# Altium project PowerMeter.PrjPcb
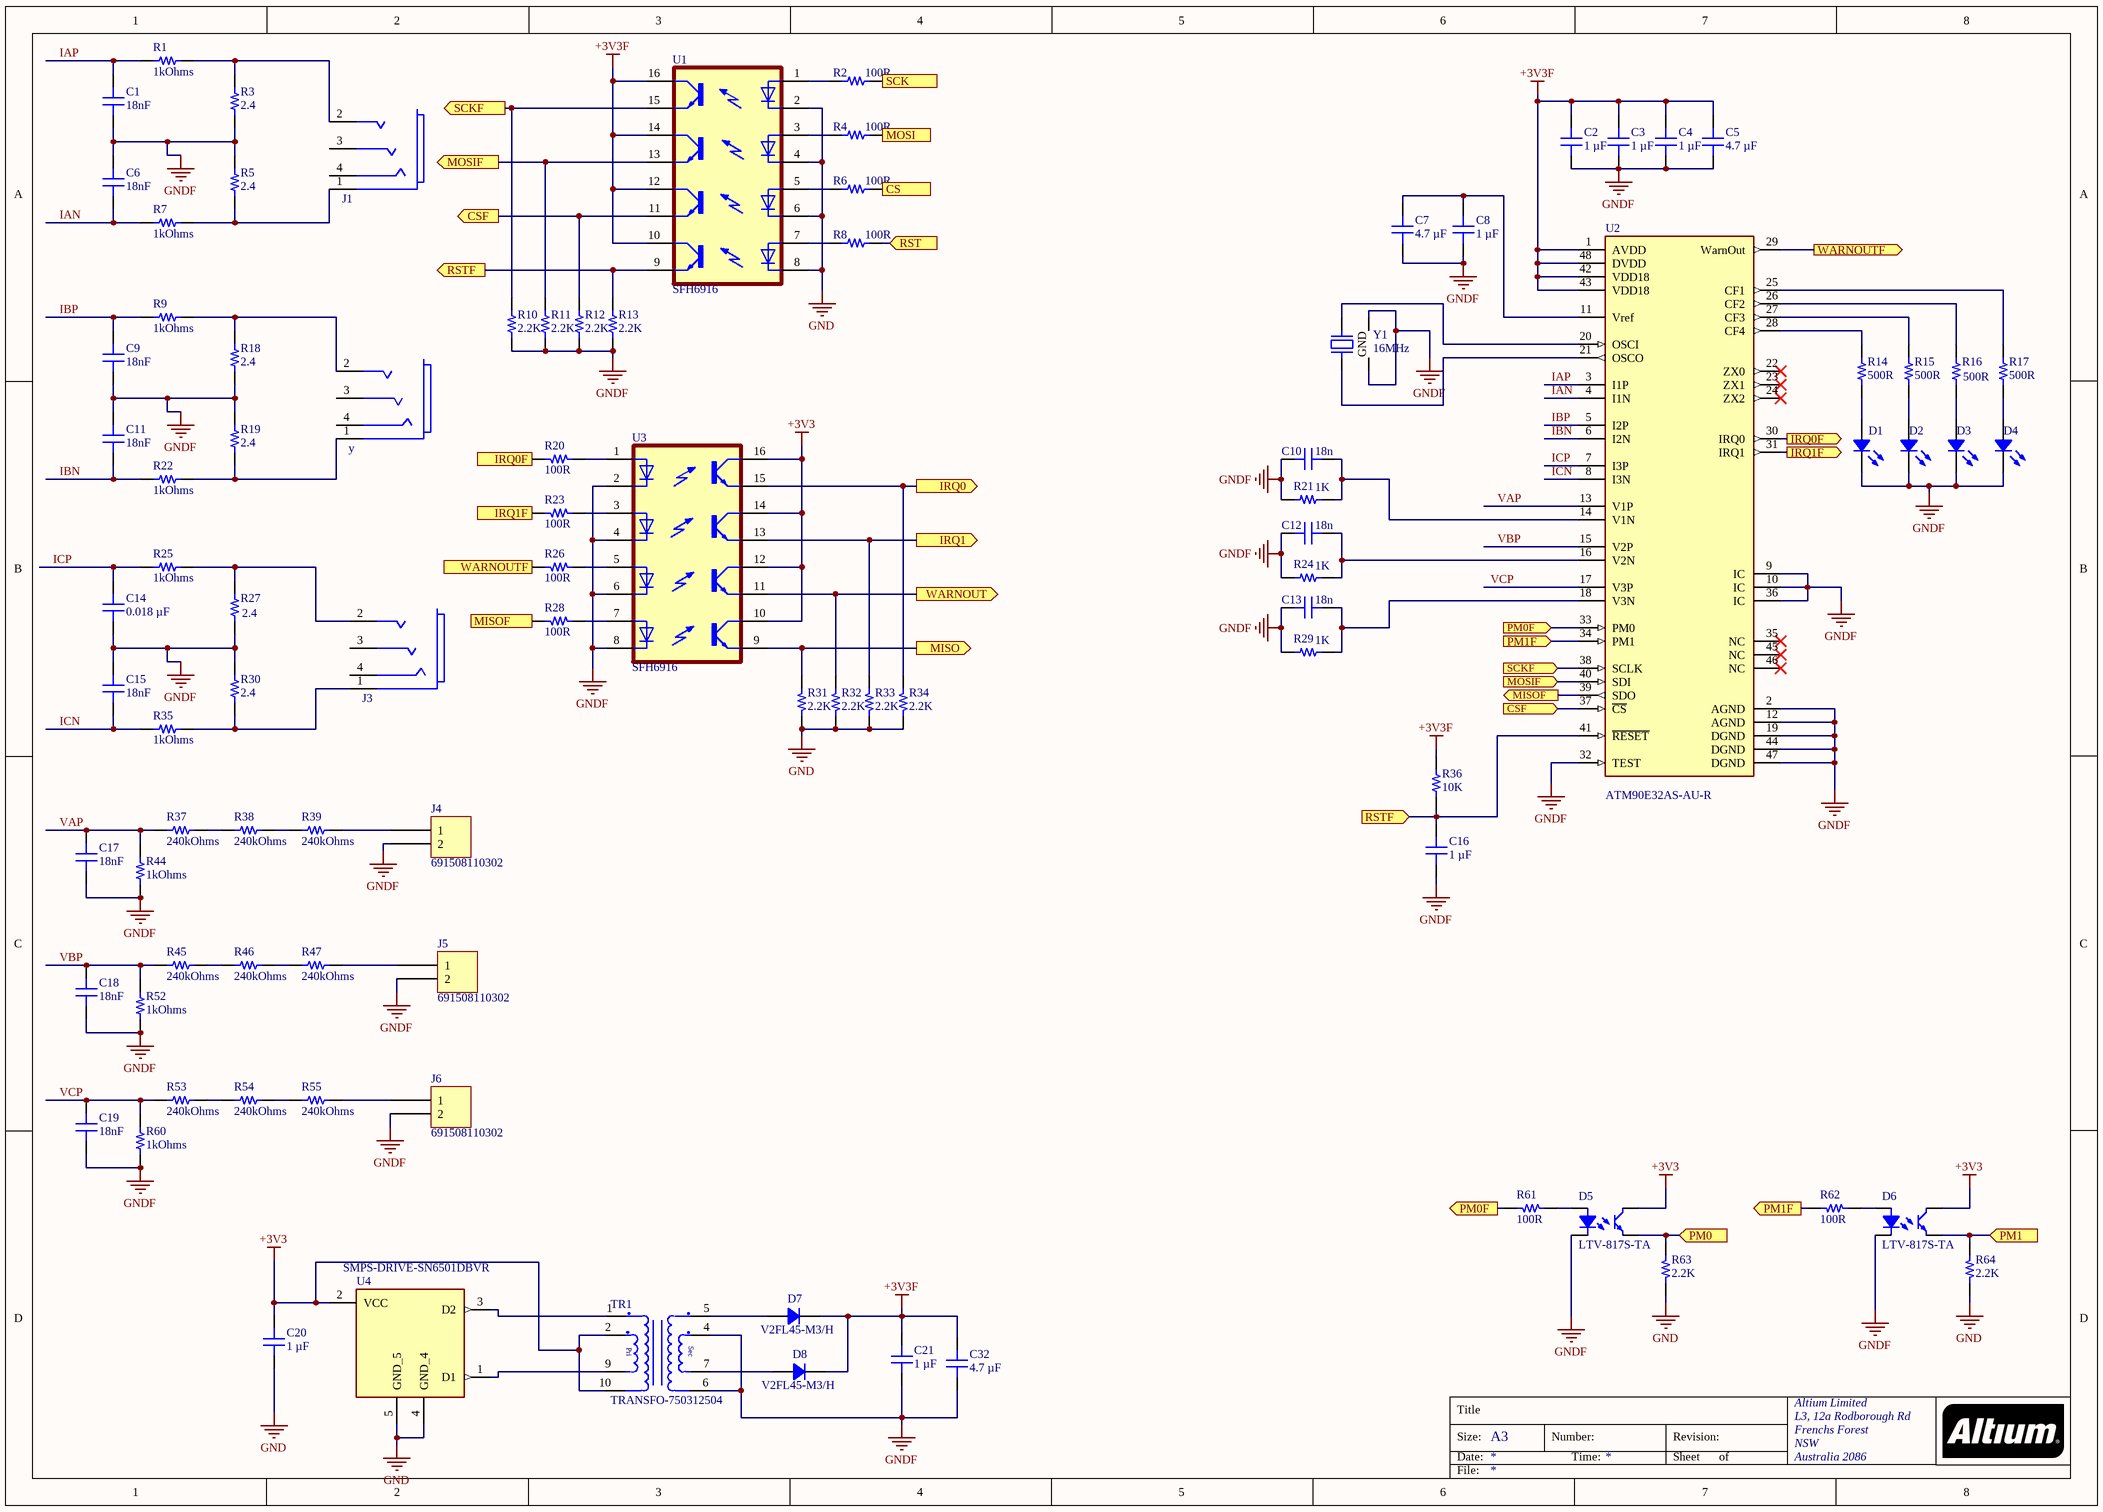
[diagram p0: schematic.SchDoc]
2 sheets, 108 parts. Net scope: flat (ports and power ports of the same name join across sheets).
Board file: pcb_layout.PcbDoc
Sheets:
  schematic.SchDoc
  power-supply.SchDoc

## Sheet schematic.SchDoc
size A3; Organization: Altium Limited; Address1: L3, 12a Rodborough Rd; Address2: Frenchs Forest; Address3: NSW; Address4: Australia 2086

### Parts
C1  18nF  [CAP 0805_2012]
C2  1 µF  [CAP 0603_1608]
C3  1 µF  [CAP 0603_1608]
C4  1 µF  [CAP 0603_1608]
C5  4.7 µF  [CAP 1206_3216 - 0.8MM]
C6  18nF  [CAP 0805_2012]
C7  4.7 µF  [CAP 1206_3216 - 0.8MM]
C8  1 µF  [CAP 0603_1608]
C9  18nF  [CAP 0805_2012]
C10  18n  [CAP 0805_2012]
C11  18nF  [CAP 0805_2012]
C12  18n  [CAP 0805_2012]
C13  18n  [CAP 0805_2012]
C14  0.018 µF  [CAP 0805_2012]
C15  18nF  [CAP 0805_2012]
C16  1 µF  [CAP 0603_1608]
C17  18nF  [CAP 0805_2012]
C18  18nF  [CAP 0805_2012]
C19  18nF  [CAP 0805_2012]
C20  1 µF  [CAP 0805_2012]
C21  1 µF  [CAP 0805_2012]
C32  4.7 µF  [CAP 1206_3216 - 0.8MM]
D1  Yellow  [LED 1206_3216 YELLOW]  (value not drawn)
D2  Yellow  [LED 1206_3216 YELLOW]  (value not drawn)
D3  Yellow  [LED 1206_3216 YELLOW]  (value not drawn)
D4  Yellow  [LED 1206_3216 YELLOW]  (value not drawn)
D5  LTV-817S-TA  [LITEON LTV-817]
D6  LTV-817S-TA  [LITEON LTV-817]
D7  V2FL45-M3/H  [SMF DO-219AB]
D8  V2FL45-M3/H  [SMF DO-219AB]
J1  SJ2-3574A-SMT-TR  [CON_JACK_AUDIO_CUISJ2-3574A-SMT-TR_MFG]  (value not drawn)
J3  SJ2-3574A-SMT-TR  [CON_JACK_AUDIO_CUISJ2-3574A-SMT-TR_MFG]  (value not drawn)
J4  691508110302  [WURTH 691508110302]
J5  691508110302  [WURTH 691508110302]
J6  691508110302  [WURTH 691508110302]
R1  1kOhms  [RES 0805_2012]
R2  100R  [RES 0805_2012]
R3  2.4  [RES 0805_2012]
R4  100R  [RES 0805_2012]
R5  2.4  [RES 0805_2012]
R6  100R  [RES 0805_2012]
R7  1kOhms  [RES 0805_2012]
R8  100R  [RES 0805_2012]
R9  1kOhms  [RES 0805_2012]
R10  2.2K  [RES 0805_2012]
R11  2.2K  [RES 0805_2012]
R12  2.2K  [RES 0805_2012]
R13  2.2K  [RES 0805_2012]
R14  500R  [RES 0805_2012]
R15  500R  [RES 0805_2012]
R16  500R  [RES 0805_2012]
R17  500R  [RES 0805_2012]
R18  2.4  [RES 0805_2012]
R19  2.4  [RES 0805_2012]
R20  100R  [RES 0805_2012]
R21  1K  [RES 0805_2012]
R22  1kOhms  [RES 0805_2012]
R23  100R  [RES 0805_2012]
R24  1K  [RES 0805_2012]
R25  1kOhms  [RES 0805_2012]
R26  100R  [RES 0805_2012]
R27  2.4  [RES 0805_2012]
R28  100R  [RES 0805_2012]
R29  1K  [RES 0805_2012]
R30  2.4  [RES 0805_2012]
R31  2.2K  [RES 0805_2012]
R32  2.2K  [RES 0805_2012]
R33  2.2K  [RES 0805_2012]
R34  2.2K  [RES 0805_2012]
R35  1kOhms  [RES 0805_2012]
R36  10K  [RES 0805_2012]
R37  240kOhms  [RES 0805_2012]
R38  240kOhms  [RES 0805_2012]
R39  240kOhms  [RES 0805_2012]
R44  1kOhms  [RES 0805_2012]
R45  240kOhms  [RES 0805_2012]
R46  240kOhms  [RES 0805_2012]
R47  240kOhms  [RES 0805_2012]
R52  1kOhms  [RES 0805_2012]
R53  240kOhms  [RES 0805_2012]
R54  240kOhms  [RES 0805_2012]
R55  240kOhms  [RES 0805_2012]
R60  1kOhms  [RES 0805_2012]
R61  100R  [RES 0805_2012]
R62  100R  [RES 0805_2012]
R63  2.2K  [RES 0805_2012]
R64  2.2K  [RES 0805_2012]
TR1  TRANSFO-750312504  [TRANSFO-750312504]
U1  SFH6916  [SOIC127P686X203-16N]
U2  ATM90E32AS-AU-R  [Microchip_TQFP48_IPC_A - duplicate]
U3  SFH6916  [SOIC127P686X203-16N]
U4  SMPS-DRIVE-SN6501DBVR  [SMPS-DRIVE-SOT95P280X145-5N]
y  SJ2-3574A-SMT-TR  [CON_JACK_AUDIO_CUISJ2-3574A-SMT-TR_MFG]  (value not drawn)
Y1  16MHz  [EPSON TSX-3225]

### Ports
CS (in), CSF (in), CSF (out), IRQ0 (out), IRQ0F (in), IRQ0F (out), IRQ1 (out), IRQ1F (in), IRQ1F (out), MISO (out), MISOF (in), MISOF (out), MOSI (in), MOSIF (in), MOSIF (out), PM0 (in), PM0F (in), PM0F (out), PM1 (in), PM1F (in), PM1F (out), RST (in), RSTF (in), RSTF (out), SCK (in), SCKF (in), SCKF (out), WARNOUT (out), WARNOUTF (in), WARNOUTF (out)

### Nets
+3V3: C20.2 D5.4 D6.4 TR1.2 TR1.10 U3.10(CO4) U3.12(CO3) U3.14(CO2) U3.16(CO1) U4.2(VCC)
+3V3F: C2.2 C3.2 C4.2 C5.2 C21.2 C32.2 D7.2 D8.2 R36.2 U1.10(CO4) U1.12(CO3) U1.14(CO2) U1.16(CO1) U2.1(AVDD) U2.42(VDD18) U2.43(VDD18) U2.48(DVDD)
GND: C20.1 R31.1 R32.1 R33.1 R34.1 R63.1 R64.1 U1.2(C1) U1.4(C2) U1.6(C3) U1.8(C4) U4.4(GND_4) U4.5(GND_5)
GNDF: C1.2 C2.1 C3.1 C4.1 C5.1 C6.1 C7.1 C8.1 C9.2 C10.1 C11.1 C12.1 C13.1 C14.1 C15.1 C16.1 C17.1 C18.1 C19.1 C21.1 C32.1 D1.2 D2.2 D3.2 D4.2 D5.2 D6.2 J4.2 J5.2 J6.2 R3.2 R5.1 R10.1 R11.1 R12.1 R13.1 R18.2 R19.1 R21.1 R24.1 R27.2 R29.1 R30.1 R44.1 R52.1 R60.1 TR1.4 TR1.6 U2.2(AGND) U2.9(IC) U2.10(IC) U2.12(AGND) U2.19(DGND) U2.32(TEST) U2.36(IC) U2.44(DGND) U2.47(DGND) U3.2(C1) U3.4(C2) U3.6(C3) U3.8(C4) Y1.2(GND) Y1.4(GND)
IAN: C6.2 R7.2 U2.4(I1N)
IAP: C1.1 R1.2 U2.3(I1P)
IBN: C11.2 R22.2 U2.6(I2N)
IBP: C9.1 R9.2 U2.5(I2P)
ICN: C15.2 R35.2 U2.8(I3N)
ICP: C14.2 R25.2 U2.7(I3P)
VAP: C17.2 R37.1 R44.2 U2.13(V1P)
VBP: C18.2 R45.1 R52.2 U2.15(V2P)
VCP: C19.2 R53.1 R60.2 U2.17(V3P)
NetC7_2: C7.2 C8.2 U2.11(Vref)
NetC10_2: C10.2 R21.2 U2.14(V1N)
NetC12_2: C12.2 R24.2 U2.16(V2N)
NetC13_2: C13.2 R29.2 U2.18(V3N)
NetC16_2: C16.2 R13.2 R36.1 U1.9(E4) U2.41(~{RESET}) ; port RSTF
NetD1_1: D1.1 R14.1
NetD2_1: D2.1 R15.2
NetD3_1: D3.1 R16.2
NetD4_1: D4.1 R17.2
NetD5_1: D5.1 R61.1
NetD5_3: D5.3 R63.2 ; port PM0
NetD6_1: D6.1 R62.1
NetD6_3: D6.3 R64.2 ; port PM1
NetD7_1: D7.1 TR1.5
NetD8_1: D8.1 TR1.7
NetJ1_1: J1.1(sleeve) R5.2 R7.1
NetJ1_2: J1.2(tip) R1.1 R3.1
NetJ3_1: J3.1(sleeve) R30.2 R35.1
NetJ3_2: J3.2(tip) R25.1 R27.1
NetJ4_1: J4.1 R39.2
NetJ5_1: J5.1 R47.2
NetJ6_1: J6.1 R55.2
NetR2_1: R2.1 U1.1(A1)
NetR2_2: R2.2 ; port SCK
NetR4_1: R4.1 U1.3(A2)
NetR4_2: R4.2 ; port MOSI
NetR6_1: R6.1 U1.5(A3)
NetR6_2: R6.2 ; port CS
NetR8_1: R8.1 U1.7(A4)
NetR8_2: R8.2 ; port RST
NetR9_1: R9.1 R18.1 y.2(tip)
NetR10_2: R10.2 U1.15(E1) U2.38(SCLK) ; port SCKF
NetR11_2: R11.2 U1.13(E2) U2.40(SDI) ; port MOSIF
NetR12_2: R12.2 U1.11(E3) U2.37(~{CS}) ; port CSF
NetR14_2: R14.2 U2.28(CF4)
NetR15_1: R15.1 U2.27(CF3)
NetR16_1: R16.1 U2.26(CF2)
NetR17_1: R17.1 U2.25(CF1)
NetR19_2: R19.2 R22.1 y.1(sleeve)
NetR20_1: R20.1 U3.1(A1)
NetR20_2: R20.2 U2.30(IRQ0) ; port IRQ0F
NetR23_1: R23.1 U3.3(A2)
NetR23_2: R23.2 U2.31(IRQ1) ; port IRQ1F
NetR26_1: R26.1 U3.5(A3)
NetR26_2: R26.2 U2.29(WarnOut) ; port WARNOUTF
NetR28_1: R28.1 U3.7(A4)
NetR28_2: R28.2 U2.39(SDO) ; port MISOF
NetR31_2: R31.2 U3.9(E4) ; port MISO
NetR32_2: R32.2 U3.11(E3) ; port WARNOUT
NetR33_2: R33.2 U3.13(E2) ; port IRQ1
NetR34_2: R34.2 U3.15(E1) ; port IRQ0
NetR37_2: R37.2 R38.1
NetR38_2: R38.2 R39.1
NetR45_2: R45.2 R46.1
NetR46_2: R46.2 R47.1
NetR53_2: R53.2 R54.1
NetR54_2: R54.2 R55.1
NetR61_2: R61.2 U2.33(PM0) ; port PM0F
NetR62_2: R62.2 U2.34(PM1) ; port PM1F
NetTR1_1: TR1.1 U4.3(D2)
NetTR1_9: TR1.9 U4.1(D1)
NetU2_20: U2.20(OSCI) Y1.3
NetU2_21: U2.21(OSCO) Y1.1

Not connected (* = marked no-connect by the designer): J1 3(ring_1) 4(ring_2); J3 3(ring_1) 4(ring_2); U2 22(ZX0)* 23(ZX1)* 24(ZX2)* 35(NC)* 45(NC)* 46(NC)*; y 3(ring_1) 4(ring_2)

### Notes on the sheet
- Title
- Size:
- Date:
- A3
- Number:
- Time:
- Revision:
- Sheet
- of
- File:
- (in symbol TRANSFO-750312504) Sec; Pri

### Library data of the parts
C1 C6 C9 C11 C15 C17-C19 = GQM2195C2E100FB12D: CAP CER 10PF 250V C0G/NP0 0805; Manufacturer: Murata Electronics; Temperature Coefficient: C0G, NP0; Tolerance: ±1%; Part Number: GQM2195C2E100FB12D; Value: 18nF; Applications: RF, Microwave, High Frequency; Capacitance: 10pF; ComponentLink1Description: Datasheet; ComponentLink1URL: https://www.murata.com/~/media/webrenewal/support/library/catalog/products/capacitor/mlcc/c02e.ashx?la=en-us; ComponentLink2Description: DigiKey Link; ComponentLink2URL: http://digikey.com/product-detail/en/murata-electronics/GQM2195C2E100FB12D/490-11280-1-ND/5333120; Device Package: 0805 (2012 Metric); Features: High Q, Low Loss; LastUpdated: 9/2/2020 1:04:42 AM; Lifecycle Status: Active; Minimum Order: 1; Mounting Type: Surface Mount, MLCC; Operating Temperature: -55°C ~ 125°C; Package / Case: 0805 (2012 Metric); Packaging: TapeAndReel; PartId: 2417; Part Status: Active; Price: 0.48; Series: GQM; Size / Dimension: 0.079" L x 0.049" W (2.00mm x 1.25mm); Supplier 1: DigiKey; Supplier Part Number 1: 490-11280-1-ND; Thickness (Max): 0.037" (0.95mm); Voltage - Rated: 250V
C2-C4 C8 C16 = C0603C105K4RACAUTO: CAP CER 0603 1UF 16V X7R 10%; manufacturer: KEMET; Part Number: C0603C105K4RACAUTO; Value: 1 µF; Applications: Automotive, Bypass, Decoupling; Capacitance: 1 µF; componentlink1description: Datasheet; componentlink1url: https://api.kemet.com/component-edge/download/datasheet/C0603C105K4RACAUTO.pdf; componentlink2description: DigiKey Link; componentlink2url: https://www.digikey.com/en/products/detail/kemet/C0603C105K4RACAUTO/8635831; Device Package: 0603 (1608 Metric); lastupdated: 6/30/2022 10:03:44 PM; Lifecycle Status: Active; Minimum Order: 1; Mounting Type: Surface Mount, MLCC; Operating Temperature: -55°C ~ 125°C; Package / Case: 0603 (1608 Metric); packaging: TapeAndReel; partid: 2179; Part Status: Active; price: 0.01; Ratings: AEC-Q200; series: SMD Auto X7R; Size / Dimension: 0.063" L x 0.031" W (1.60mm x 0.80mm); Supplier 1: DigiKey; Supplier Part Number 1: 399-17704-1-ND; Temperature Coefficient: X7R; Thickness (Max): 0.037" (0.95mm); Tolerance: ±10%; Voltage - Rated: 16V
C5 C7 C32 = EMF316AB7475KLHT: CAP, MLCC, 1206/3216, 16V, X7R,; manufacturer: Taiyo Yuden; Tolerance: ±10%; Part Number: EMF316AB7475KLHT; Value: 4.7 µF; Applications: Automotive, SMPS Filtering; Capacitance: 4.7 µF; componentlink1description: Datasheet; componentlink1url: https://ds.yuden.co.jp/TYCOMPAS/ut/detail?pn=EMF316AB7475KLHT&u=M; componentlink2description: DigiKey Link; componentlink2url: https://www.digikey.com/en/products/detail/taiyo-yuden/EMF316AB7475KLHT/10379053; Device Package: 1206 (3216 Metric); lastupdated: 6/30/2022 10:08:55 PM; Lifecycle Status: Active; Minimum Order: 1; Mounting Type: Surface Mount, MLCC; Operating Temperature: -55°C ~ 125°C; Package / Case: 1206 (3216 Metric); packaging: TapeAndReel; partid: 22602; Part Status: Active; price: 0.10; Ratings: AEC-Q200; series: M; Size / Dimension: 0.126" L x 0.063" W (3.20mm x 1.60mm); Supplier 1: DigiKey; Supplier Part Number 1: 587-6487-1-ND; Temperature Coefficient: X7R; Thickness (Max): 0.071" (1.80mm); Voltage - Rated: 16V
C10 C12 C13 = CC0805KRX7R0BB183: CAP CER 0.018UF 100V X7R 0805; manufacturer: Yageo; Capacitance: 0.018 µF; Tolerance: ±10%; Part Number: CC0805KRX7R0BB183; Value: 18n; Applications: General Purpose; componentlink1description: Datasheet; componentlink1url: http://www.yageo.com/documents/recent/UPY-NP0X7R_MV_100-to-630V_21.pdf; componentlink2description: DigiKey Link; componentlink2url: https://www.digikey.com/en/products/detail/yageo/CC0805KRX7R0BB183/5884190; Device Package: 0805 (2012 Metric); Features: High Voltage; lastupdated: 6/30/2022 10:07:03 PM; Lifecycle Status: Active; Minimum Order: 1; Mounting Type: Surface Mount, MLCC; Operating Temperature: -55°C ~ 125°C; Package / Case: 0805 (2012 Metric); packaging: TapeAndReel; partid: 2523; Part Status: Active; price: 0.02; series: CC; Size / Dimension: 0.079" L x 0.049" W (2.00mm x 1.25mm); Supplier 1: DigiKey; Supplier Part Number 1: 311-4304-1-ND; Temperature Coefficient: X7R; Thickness (Max): 0.057" (1.45mm); Voltage - Rated: 100V
C14 = CC0805KRX7R0BB183: CAP CER 0.018UF 100V X7R 0805; manufacturer: Yageo; Tolerance: ±10%; Part Number: CC0805KRX7R0BB183; Value: 0.018 µF; Applications: General Purpose; Capacitance: 0.018 µF; componentlink1description: Datasheet; componentlink1url: http://www.yageo.com/documents/recent/UPY-NP0X7R_MV_100-to-630V_21.pdf; componentlink2description: DigiKey Link; componentlink2url: https://www.digikey.com/en/products/detail/yageo/CC0805KRX7R0BB183/5884190; Device Package: 0805 (2012 Metric); Features: High Voltage; lastupdated: 7/14/2022 11:52:55 AM; Lifecycle Status: Active; Minimum Order: 1; Mounting Type: Surface Mount, MLCC; Operating Temperature: -55°C ~ 125°C; Package / Case: 0805 (2012 Metric); packaging: TapeAndReel; partid: 2523; Part Status: Active; price: 0.02; series: CC; Size / Dimension: 0.079" L x 0.049" W (2.00mm x 1.25mm); Supplier 1: DigiKey; Supplier Part Number 1: 311-4304-1-ND; Temperature Coefficient: X7R; Thickness (Max): 0.057" (1.45mm); Voltage - Rated: 100V
C20 C21 = CGA4J3X8R1C105K125AB: CAP CER 1UF 16V X8R 0805; manufacturer: TDK Corporation; Tolerance: ±10%; Part Number: CGA4J3X8R1C105K125AB; Value: 1 µF; Applications: Automotive; Capacitance: 1 µF; componentlink1description: Datasheet; componentlink1url: https://product.tdk.com/info/en/catalog/datasheets/mlcc_automotive_hightemp_en.pdf?ref_disty=digikey; componentlink2description: DigiKey Link; componentlink2url: https://www.digikey.com/en/products/detail/tdk-corporation/CGA4J3X8R1C105K125AB/3950048; Device Package: 0805 (2012 Metric); Features: High Temperature; lastupdated: 6/30/2022 10:07:02 PM; Lifecycle Status: Active; Minimum Order: 1; Mounting Type: Surface Mount, MLCC; Operating Temperature: -55°C ~ 150°C; Package / Case: 0805 (2012 Metric); packaging: TapeAndReel; partid: 3048; Part Status: Active; price: 0.08; Ratings: AEC-Q200; series: CGA; Size / Dimension: 0.079" L x 0.049" W (2.00mm x 1.25mm); Supplier 1: DigiKey; Supplier Part Number 1: 445-12812-1-ND; Temperature Coefficient: X8R; Thickness (Max): 0.057" (1.45mm); Voltage - Rated: 16V
D1-D4 = 5990240007F: LED YELLOW 1206 SMD; Manufacturer: Dialight; Configuration: Standard; Current - Test: 20mA; Lens Color: 0.80mm; Lens Size: 2.00mm x 1.60mm; Lens Style: Rectangle with Flat Top; Millicandela Rating: 126mcd; Viewing Angle: 140°; Voltage - Forward (Vf) (Typ): 2.1V; Wavelength - Dominant: 590nm; Part Number: 5990240007F; Color: Yellow; ComponentLink1Description: Datasheet; ComponentLink1URL: http://www.dialightsignalsandcomponents.com/Assets/Brochures_And_Catalogs/Indication/CBI_SMD_new/Dialight_CBI_data_599-1206_Apr2018.pdf; ComponentLink2Description: DigiKey Link; ComponentLink2URL: https://www.digikey.com/en/products/detail/dialight/5990240007F/9385418; Device Package: 1206 (3216 Metric); Height (Max): 0.80mm; LastUpdated: 6/30/2022 10:51:53 PM; Lifecycle Status: Active; Minimum Order: 1; Mounting Type: Surface Mount; Package / Case: 1206 (3216 Metric); Packaging: TapeAndReel; PartId: 1; Part Status: Active; Price: 0.04; Series: 599; Size / Dimension: 3.20mm L x 1.60mm W; Supplier 1: DigiKey; Supplier Part Number 1: 350-4363-1-ND; Supplier Device Package: 1206; Value: Yellow
D5 D6 = LTV-817S-TA: OPTOISOLATR 5KV TRANSISTOR 4-SMD; Manufacturer: Lite-On Inc.; Current - DC Forward (If) (Max): 50mA; Current Transfer Ratio (Max): 600% @ 5mA; Current Transfer Ratio (Min): 50% @ 5mA; Input Type: DC; Number of Channels: 1; Rise / Fall Time (Typ): 4µs, 3µs; Vce Saturation (Max): 200mV; Voltage - Forward (Vf) (Typ): 1.2V; Voltage - Isolation: 5000Vrms; Voltage - Output (Max): 35V; Part Number: LTV-817S-TA; ComponentLink1Description: Datasheet; ComponentLink1URL: http://optoelectronics.liteon.com/upload/download/DS-70-96-0016/LTV-8X7%20series%20201610%20.pdf; ComponentLink2Description: DigiKey Link; ComponentLink2URL: http://digikey.com/product-detail/en/lite-on-inc/LTV-817S-TA/160-2038-1-ND/3711420; Current - Output / Channel: 50mA; Device Package: 4-SMD, Gull Wing; LastUpdated: 1/12/2020 9:59:02 PM; Lifecycle Status: Active; Minimum Order: 1; Mounting Type: Surface Mount; Operating Temperature: -30°C ~ 110°C; Output Type: Transistor; Package / Case: 4-SMD, Gull Wing; Packaging: TapeAndReel; Part Status: Active; Price: 0.12; Series: -; Supplier 1: DigiKey; Supplier Part Number 1: 160-2038-1-ND; Supplier Device Package: 4-SMD
D7 D8 = V2FL45-M3/H: 2A,45V,SMF,TRENCH SKY RECT.; Manufacturer: Vishay Semiconductor Diodes Division; Capacitance @ Vr, F: 270pF @ 4V, 1MHz; Current - Reverse Leakage @ Vr: 570µA @ 45V; Diode Type: Schottky; Speed: Fast Recovery =< 500ns, > 200mA (Io); Voltage - Forward (Vf) (Max) @ If: 560mV @ 2A; Part Number: V2FL45-M3/H; ComponentLink1Description: Datasheet; ComponentLink1URL: http://www.vishay.com/docs/87561/v2fl45.pdf; ComponentLink2Description: DigiKey Link; ComponentLink2URL: http://digikey.com/product-detail/en/vishay-semiconductor-diodes-division/V2FL45-M3-H/V2FL45-M3-HGICT-ND/9360081; Current - Average Rectified (Io): 2A; LastUpdated: 6/30/2022 10:54:15 PM; Lifecycle Status: Active; Minimum Order: 1; Mounting Type: Surface Mount; Operating Temperature - Junction: -40°C ~ 150°C; Package / Case: DO-219AB; Packaging: TapeAndReel; PartId: 1281; Part Status: Active; Price: 0.08; Series: eSMP®, TMBS®; Supplier 1: DigiKey; Supplier Part Number 1: V2FL45-M3/HGICT-ND; Supplier Device Package: DO-219AB (SMF); Voltage - DC Reverse (Vr) (Max): 45V
J1 J3 y = CON_JACK_AUDIO_SJ2-3574A-SMT-TR: 3.5 mm, Stereo, Right Angle, Surface Mount (SMT), Audio Jack Connector
J4-J6 = 691508110302: TERM BLOCK 2POS 3.5MM SMD; Manufacturer: Würth Elektronik; Current: 10A; Mating Orientation: Horizontal and Vertical with Board; Number of Levels: 1; Pitch: 0.138" (3.50mm); Positions Per Level: 2; Voltage: 300V; Wire Gauge: 16-30 AWG; Wire Termination: Screw - Rising Cage Clamp; Part Number: 691508110302; Color: Black; ComponentLink1Description: Datasheet; ComponentLink1URL: https://katalog.we-online.de/em/datasheet/6915081103xx.pdf; ComponentLink2Description: DigiKey Link; ComponentLink2URL: http://digikey.com/product-detail/en/w-rth-elektronik/691508110302/732-5963-1-ND/5047612; Features: Board Guide, Mounting Flange; LastUpdated: 1/15/2020 4:18:55 AM; Lifecycle Status: Active; Minimum Order: 1; Mounting Type: Surface Mount; Packaging: TapeAndReel; Part Status: Active; Price: 1.57; Series: WR-TBL Series 5081; Supplier 1: DigiKey; Supplier Part Number 1: 732-5963-1-ND
R1 R3 R5 R7 R9 R18 R19 R22 R25 R27 R30 R35 R37-R39 R44-R47 R52-R55 R60 = RC0805FR-0710KP: RES SMD 10K OHM 1% 1/8W 0805; Manufacturer: Yageo; Power (Watts): 0.125W, 1/8W; Resistance: 10 kOhms; Temperature Coefficient: ±100ppm/°C; Part Number: RC0805FR-0710KP; ComponentLink1Description: Datasheet; ComponentLink1URL: http://www.yageo.com/NewPortal/yageodocoutput?fileName=/pdf/R-Chip/PYu-RC_51_RoHS_P_0.pdf; ComponentLink2Description: DigiKey Link; ComponentLink2URL: http://digikey.com/product-detail/en/yageo/RC0805FR-0710KP/YAG1319CT-ND/4935432; Composition: Thick Film; Device Package: 0805 (2012 Metric); Features: Moisture Resistant; Height - Seated (Max): 0.024" (0.60mm); LastUpdated: 9/2/2020 1:14:57 AM; Lifecycle Status: Active; Minimum Order: 1; Number of Terminations: 2; Operating Temperature: -55°C ~ 155°C; Package / Case: 0805 (2012 Metric); Packaging: TapeAndReel; PartId: 39882; Part Status: Active; Price: 0.01; Series: RC-P Lead Free; Size / Dimension: 0.079" L x 0.049" W (2.00mm x 1.25mm); Supplier 1: DigiKey; Supplier Part Number 1: YAG1319CT-ND; Supplier Device Package: 0805; Tolerance: ±1%
  R1 R7 R9 R22 R25 R35 R44 R52 R60: Value: 1kOhms
  R3 R5 R18 R19 R27 R30: Value: 2.4
  R37-R39 R45-R47 R53-R55: Value: 240kOhms
R2 R4 R6 R8 R20 R23 R26 R28 R61 R62 = RCS0805100RFKEA: RES SMD 100 OHM 1% 0.4W 0805; Manufacturer: Vishay Dale; Power (Watts): 0.4W, 2/5W; Resistance: 100 Ohms; Temperature Coefficient: ±100ppm/°C; Part Number: RCS0805100RFKEA; Value: 100R; ComponentLink1Description: Datasheet; ComponentLink1URL: http://www.vishay.com/docs/20065/rcse3.pdf; ComponentLink2Description: DigiKey Link; ComponentLink2URL: https://www.digikey.com/en/products/detail/vishay-dale/RCS0805100RFKEA/5866980; Composition: Thick Film; Device Package: 0805 (2012 Metric); Features: Automotive AEC-Q200, Pulse Withstanding; Height - Seated (Max): 0.020" (0.50mm); LastUpdated: 6/30/2022 10:39:30 PM; Lifecycle Status: Active; Minimum Order: 1; Number of Terminations: 2; Operating Temperature: -55°C ~ 155°C; Package / Case: 0805 (2012 Metric); Packaging: TapeAndReel; PartId: 27784; Part Status: Active; Price: 0.03; Ratings: AEC-Q200; Series: RCS e3; Size / Dimension: 0.079" L x 0.049" W (2.00mm x 1.25mm); Supplier 1: DigiKey; Supplier Part Number 1: 541-2834-1-ND; Supplier Device Package: 0805; Tolerance: ±1%
R10-R13 R31-R34 R63 R64 = SR0805JR-7W2K2L: RES SMD 2.2K OHM 5% 1/4W 0805; Manufacturer: Yageo; Power (Watts): 0.25W, 1/4W; Resistance: 2.2 kOhms; Temperature Coefficient: ±200ppm/°C; Part Number: SR0805JR-7W2K2L; Value: 2.2K; ComponentLink1Description: Datasheet; ComponentLink1URL: http://www.yageo.com/documents/recent/PYu-SR_20105_RoHS_L_8.pdf; ComponentLink2Description: DigiKey Link; ComponentLink2URL: http://digikey.com/product-detail/en/yageo/SR0805JR-7W2K2L/YAG6054CT-ND/9696508; Composition: Thick Film; Device Package: 0805 (2012 Metric); Features: Automotive AEC-Q200, Pulse Withstanding; Height - Seated (Max): 0.024" (0.60mm); LastUpdated: 6/30/2022 10:39:29 PM; Lifecycle Status: Active; Minimum Order: 1; Number of Terminations: 2; Operating Temperature: -55°C ~ 155°C; Package / Case: 0805 (2012 Metric); Packaging: TapeAndReel; PartId: 27793; Part Status: Active; Price: 0.03; Ratings: AEC-Q200; Series: SR; Size / Dimension: 0.079" L x 0.049" W (2.00mm x 1.25mm); Supplier 1: DigiKey; Supplier Part Number 1: YAG6054CT-ND; Supplier Device Package: 0805; Tolerance: ±5%
R14-R17 = TNPU0805500RAZEN00: RES SMD 500 OHM 0.05% 1/8W 0805; Manufacturer: Vishay Dale; Power (Watts): 0.125W, 1/8W; Resistance: 500 Ohms; Temperature Coefficient: ±5ppm/°C; Part Number: TNPU0805500RAZEN00; Value: 500R; ComponentLink1Description: Datasheet; ComponentLink1URL: http://www.vishay.com/docs/28779/tnpue3.pdf; ComponentLink2Description: DigiKey Link; ComponentLink2URL: http://digikey.com/product-detail/en/vishay-dale/TNPU0805500RAZEN00/541-3305-1-ND/6615962; Composition: Thin Film; Device Package: 0805 (2012 Metric); Features: Anti-Sulfur, Automotive AEC-Q200, Moisture Resistant; Height - Seated (Max): 0.022" (0.55mm); LastUpdated: 6/30/2022 10:39:04 PM; Lifecycle Status: Active; Minimum Order: 1; Number of Terminations: 2; Operating Temperature: -55°C ~ 125°C; Package / Case: 0805 (2012 Metric); Packaging: TapeAndReel; PartId: 34406; Part Status: Active; Price: 1.23; Ratings: AEC-Q200; Series: TNPU; Size / Dimension: 0.079" L x 0.049" W (2.00mm x 1.25mm); Supplier 1: DigiKey; Supplier Part Number 1: 541-3305-1-ND; Supplier Device Package: 0805; Tolerance: ±0.05%
R21 R24 R29 = RNCS0805BKE1K00: RES 1K OHM 0.1% 1/10W 0805; Manufacturer: Stackpole Electronics Inc; Power (Watts): 0.1W, 1/10W; Resistance: 1 kOhms; Temperature Coefficient: ±25ppm/°C; Part Number: RNCS0805BKE1K00; Value: 1K; ComponentLink1Description: Datasheet; ComponentLink1URL: https://www.seielect.com/catalog/sei-rncs_rnch.pdf; ComponentLink2Description: DigiKey Link; ComponentLink2URL: https://www.digikey.com/en/products/detail/stackpole-electronics-inc/RNCS0805BKE1K00/1800073; Composition: Thin Film; Device Package: 0805 (2012 Metric); Features: Anti-Corrosive, Automotive AEC-Q200, Moisture Resistant; Height - Seated (Max): 0.026" (0.65mm); LastUpdated: 6/30/2022 10:39:30 PM; Lifecycle Status: Active; Minimum Order: 1; Number of Terminations: 2; Operating Temperature: -55°C ~ 155°C; Package / Case: 0805 (2012 Metric); Packaging: TapeAndReel; PartId: 27715; Part Status: Active; Price: 0.09; Ratings: AEC-Q200; Series: RNCS; Size / Dimension: 0.079" L x 0.049" W (2.00mm x 1.25mm); Supplier 1: DigiKey; Supplier Part Number 1: RNCS0805BKE1K00CT-ND; Supplier Device Package: 0805; Tolerance: ±0.1%
R36 = RNCS0805BKE10K0: RES 10K OHM 0.1% 1/10W 0805; Manufacturer: Stackpole Electronics Inc; Power (Watts): 0.1W, 1/10W; Resistance: 10 kOhms; Temperature Coefficient: ±25ppm/°C; Part Number: RNCS0805BKE10K0; Value: 10K; ComponentLink1Description: Datasheet; ComponentLink1URL: https://www.seielect.com/catalog/sei-rncs_rnch.pdf; ComponentLink2Description: DigiKey Link; ComponentLink2URL: https://www.digikey.com/en/products/detail/stackpole-electronics-inc/RNCS0805BKE10K0/1800067; Composition: Thin Film; Device Package: 0805 (2012 Metric); Features: Anti-Corrosive, Automotive AEC-Q200, Moisture Resistant; Height - Seated (Max): 0.026" (0.65mm); LastUpdated: 6/30/2022 10:39:30 PM; Lifecycle Status: Active; Minimum Order: 1; Number of Terminations: 2; Operating Temperature: -55°C ~ 155°C; Package / Case: 0805 (2012 Metric); Packaging: TapeAndReel; PartId: 27713; Part Status: Active; Price: 0.09; Ratings: AEC-Q200; Series: RNCS; Size / Dimension: 0.079" L x 0.049" W (2.00mm x 1.25mm); Supplier 1: DigiKey; Supplier Part Number 1: RNCS0805BKE10K0CT-ND; Supplier Device Package: 0805; Tolerance: ±0.1%
TR1 = TRANSFO-750312504: Capacitor Charger For For DC/DC Converters SMPS Transformer 500VDC Isolation - Surface Mount
U1 U3 = SFH6916: MF: {'manufacturer': u'Vishay'}; Package: None; Price: None; Value: *; MP: SFH6916; Availability: Unavailable
U2 = ATM90E32AS-AU-R: Smart Energy SoC, 3 - 3.6 VCC, -40 to 85 degC, TQFP-48, RoHS; Supplier 1: Avnet; Supplier Part Number 1: ATM90E32AS-AU-R
U4 = SMPS-DRIVE-SN6501DBVR: Low-noise, 350-mA, 410-kHz transformer driver for isolated power supplies 5-SOT-23 -40 to 125; MF: Texas Instruments; SnapEDA_Link: https://www.snapeda.com/parts/SN6501DBVR/Texas%20Instruments/view-part/49700/?ref=snap; MP: SN6501DBVR; Check_prices: https://www.snapeda.com/parts/SN6501DBVR/Texas%20Instruments/view-part/49700/?ref=eda; Digi-Key_Part_Number: 296-37700-1-ND; Value: *; Purchase-URL: https://pricing.snapeda.com/search/part/SN6501DBVR/?ref=eda; Package: SOT-23-5 Texas Instruments
Y1 = TSX-3225 16.0000MF18X-AC3: CRYSTAL 16.0000MHZ 9PF SMD; Manufacturer: EPSON; ESR (Equivalent Series Resistance): 60 Ohms; Frequency Stability: ±18ppm; Frequency Tolerance: ±10ppm; Operating Mode: Fundamental; Part Number: TSX-3225 16.0000MF18X-AC3; ComponentLink1Description: Datasheet; ComponentLink1URL: https://support.epson.biz/td/api/doc_check.php?dl=brief_TSX-3225&lang=en; ComponentLink2Description: DigiKey Link; ComponentLink2URL: http://digikey.com/product-detail/en/epson/TSX-3225-16.0000MF18X-AC3/SER3636CT-ND/1825448; Frequency: 16MHz; Height - Seated (Max): 0.024" (0.60mm); LastUpdated: 7/21/2022 4:44:27 AM; Lifecycle Status: Active; Load Capacitance: 9pF; Minimum Order: 1; Mounting Type: Surface Mount; Operating Temperature: -40°C ~ 85°C; Package / Case: 4-SMD, No Lead; Packaging: TapeAndReel; PartId: 443; Part Status: Active; Price: 0.22; Series: TSX-3225; Size / Dimension: 0.126" L x 0.098" W (3.20mm x 2.50mm); Supplier 1: DigiKey; Supplier Part Number 1: SER3636CT-ND; Type: MHz Crystal; Value: 16MHz

## Sheet power-supply.SchDoc
size A3
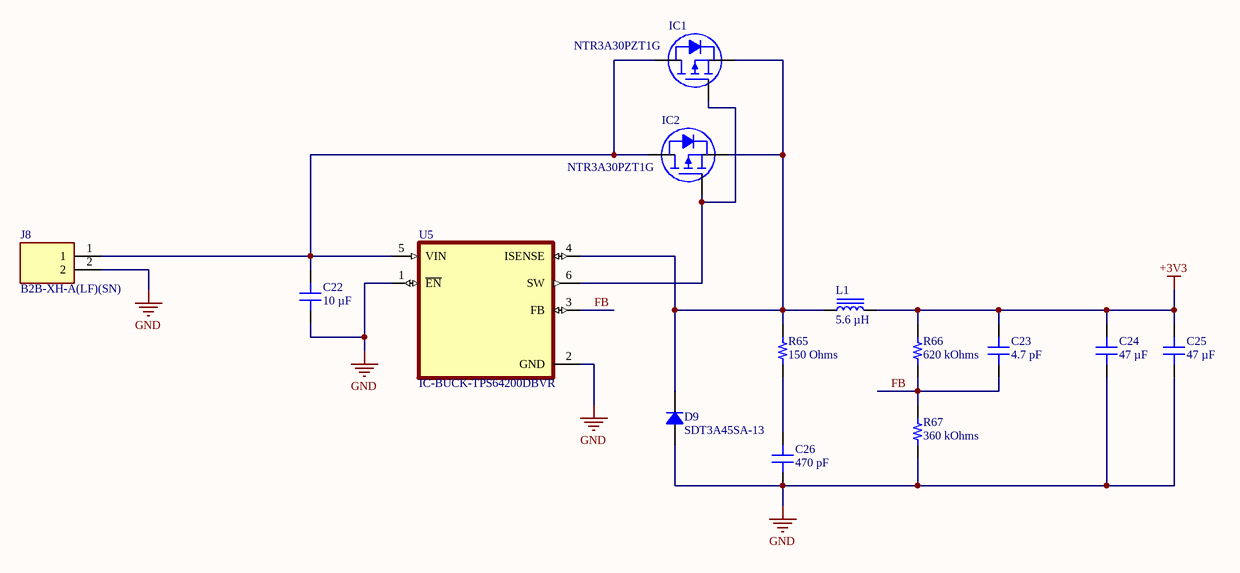
[diagram p1: power-supply.SchDoc]

### Parts
C22  10 µF  [CAP 1206_3216 - 0.8MM]
C23  4.7 pF  [CAP 0603_1608]
C24  47 µF  [CAP 0603_1608]
C25  47 µF  [CAP 1206_3216 - 0.8MM]
C26  470 pF  [CAP 0603_1608]
D9  SDT3A45SA-13  [DO214AC SMA]
IC1  NTR3A30PZT1G  [ON SEMI SOT-23-3]
IC2  NTR3A30PZT1G  [ON SEMI SOT-23-3]
J8  B2B-XH-A(LF)(SN)  [JST_B2B-XH-A(LF)(SN)]
L1  5.6 µH  [BOURNS SRP5030T]
R65  150 Ohms  [RES 1206_3216]
R66  620 kOhms  [RES 0805_2012]
R67  360 kOhms  [RES 0805_2012]
U5  IC-BUCK-TPS64200DBVR  [IC-BUCK-TPS64200DBVR-SOT95P280X145-6N]

### Nets
+3V3: C23.2 C24.2 C25.2 L1.2 R66.2
GND: C22.1 C24.1 C25.1 C26.1 D9.1 J8.2 R67.1 U5.1(~{EN}) U5.2(GND)
FB: C23.1 R66.1 R67.2 U5.3(FB)
NetC22_2: C22.2 IC1.3(D) IC2.3(D) J8.1 U5.5(VIN)
NetC26_2: C26.2 R65.1
NetD9_2: D9.2 IC1.2(S) IC2.2(S) L1.1 R65.2 U5.4(ISENSE)
NetIC1_1: IC1.1(G) IC2.1(G) U5.6(SW)

### Library data of the parts
C22 = EMK316BJ106MD-T: CAP CER 10UF 16V X5R 1206; manufacturer: Taiyo Yuden; Tolerance: ±20%; Part Number: EMK316BJ106MD-T; Value: 10 µF; Applications: SMPS Filtering; Capacitance: 10 µF; componentlink1description: Datasheet; componentlink1url: http://www.yuden.co.jp/productdata/catalog/mlcc06_e.pdf; componentlink2description: DigiKey Link; componentlink2url: https://www.digikey.com/en/products/detail/taiyo-yuden/EMK316BJ106MD-T/6563474; Device Package: 1206 (3216 Metric); lastupdated: 6/30/2022 10:09:24 PM; Lifecycle Status: Active; Minimum Order: 1; Mounting Type: Surface Mount, MLCC; Operating Temperature: -55°C ~ 85°C; Package / Case: 1206 (3216 Metric); packaging: TapeAndReel; partid: 18996; Part Status: Active; price: 0.07; series: M; Size / Dimension: 0.126" L x 0.063" W (3.20mm x 1.60mm); Supplier 1: DigiKey; Supplier Part Number 1: 587-4881-1-ND; Temperature Coefficient: X5R; Thickness (Max): 0.037" (0.95mm); Voltage - Rated: 16V
C23 = 600S4R7CT250XT: CAP CER 4.7PF 250V C0G/NP0 0603; manufacturer: American Technical Ceramics; Temperature Coefficient: C0G, NP0; Tolerance: ±0.25pF; Part Number: 600S4R7CT250XT; Value: 4.7 pF; Applications: RF, Microwave, High Frequency, Bypass, Decoupling; Capacitance: 4.7 pF; componentlink1description: Datasheet; componentlink1url: http://www.atceramics.com/UserFiles/600s.pdf; componentlink2description: DigiKey Link; componentlink2url: https://www.digikey.com/en/products/detail/american-technical-ceramics/600S4R7CT250XT/3905230; Device Package: 0603 (1608 Metric); Features: High Q, Low Loss, Ultra Low ESR; lastupdated: 6/30/2022 10:03:42 PM; Lifecycle Status: Active; Minimum Order: 1; Mounting Type: Surface Mount, MLCC; Operating Temperature: -55°C ~ 125°C; Package / Case: 0603 (1608 Metric); packaging: TapeAndReel; partid: 2945; Part Status: Active; price: 0.21; series: ATC 600S; Size / Dimension: 0.063" L x 0.032" W (1.60mm x 0.81mm); Supplier 1: DigiKey; Supplier Part Number 1: 1284-1227-1-ND; Thickness (Max): 0.035" (0.89mm); Voltage - Rated: 250V
C24 = CL10A476MR8NZNE: CAP CER 47UF 4V X5R 0603; manufacturer: Samsung Electro-Mechanics; Tolerance: ±20%; Part Number: CL10A476MR8NZNE; Value: 47 µF; Applications: General Purpose; Capacitance: 47 µF; componentlink1description: Datasheet; componentlink1url: http://www.samsungsem.com/kr/support/product-search/mlcc/CL10A476MR8NZNE.jsp; componentlink2description: DigiKey Link; componentlink2url: https://www.digikey.com/en/products/detail/samsung-electro-mechanics/CL10A476MR8NZNE/5961012; Device Package: 0603 (1608 Metric); lastupdated: 6/30/2022 10:03:30 PM; Lifecycle Status: Active; Minimum Order: 1; Mounting Type: Surface Mount, MLCC; Operating Temperature: -55°C ~ 85°C; Package / Case: 0603 (1608 Metric); packaging: TapeAndReel; partid: 6963; Part Status: Active; price: 0.46; series: CL; Size / Dimension: 0.063" L x 0.031" W (1.60mm x 0.80mm); Supplier 1: DigiKey; Supplier Part Number 1: 1276-6528-1-ND; Temperature Coefficient: X5R; Thickness (Max): 0.035" (0.90mm); Voltage - Rated: 4V
C25 = C3216X7S0J476M160AC: CAP CER 47UF 6.3V X7S 1206; manufacturer: TDK Corporation; Tolerance: ±20%; Part Number: C3216X7S0J476M160AC; Value: 47 µF; Applications: General Purpose; Capacitance: 47 µF; componentlink1description: Datasheet; componentlink1url: https://product.tdk.com/info/en/catalog/datasheets/mlcc_commercial_general_en.pdf?ref_disty=digikey; componentlink2description: DigiKey Link; componentlink2url: https://www.digikey.com/en/products/detail/tdk-corporation/C3216X7S0J476M160AC/2792275; Device Package: 1206 (3216 Metric); Features: Low ESL; lastupdated: 6/30/2022 10:09:15 PM; Lifecycle Status: Active; Minimum Order: 1; Mounting Type: Surface Mount, MLCC; Operating Temperature: -55°C ~ 125°C; Package / Case: 1206 (3216 Metric); packaging: TapeAndReel; partid: 39382; Part Status: Active; price: 0.26; series: C; Size / Dimension: 0.126" L x 0.063" W (3.20mm x 1.60mm); Supplier 1: DigiKey; Supplier Part Number 1: 445-8037-1-ND; Temperature Coefficient: X7S; Thickness (Max): 0.071" (1.80mm); Voltage - Rated: 6.3V
C26 = C0603C471J3GACAUTO: CAP CER 470PF 25V C0G/NP0 0603; manufacturer: KEMET; Temperature Coefficient: C0G, NP0; Tolerance: ±5%; Part Number: C0603C471J3GACAUTO; Value: 470 pF; Applications: Automotive; Capacitance: 470 pF; componentlink1description: Datasheet; componentlink1url: https://api.kemet.com/component-edge/download/datasheet/C0603C471J3GACAUTO.pdf; componentlink2description: DigiKey Link; componentlink2url: https://www.digikey.com/en/products/detail/kemet/C0603C471J3GACAUTO/3314886; Device Package: 0603 (1608 Metric); Features: Low ESL; lastupdated: 6/30/2022 10:03:43 PM; Lifecycle Status: Active; Minimum Order: 1; Mounting Type: Surface Mount, MLCC; Operating Temperature: -55°C ~ 125°C; Package / Case: 0603 (1608 Metric); packaging: TapeAndReel; partid: 2407; Part Status: Active; price: 0.06; Ratings: AEC-Q200; series: SMD Auto C0G; Size / Dimension: 0.063" L x 0.031" W (1.60mm x 0.80mm); Supplier 1: DigiKey; Supplier Part Number 1: 399-6891-1-ND; Thickness (Max): 0.034" (0.87mm); Voltage - Rated: 25V
D9 = SDT3A45SA-13: SCHOTTKY RECTIFIER SMA T&R 10K; Manufacturer: Diodes Incorporated; Current - Average Rectified (Io): 3A; Current - Reverse Leakage @ Vr: 280 µA @ 45 V; Speed: Fast Recovery =< 500ns, > 200mA (Io); Voltage - DC Reverse (Vr) (Max): 45 V; Voltage - Forward (Vf) (Max) @ If: 480 mV @ 3 A; Part Number: SDT3A45SA-13; ComponentLink1Description: Datasheet; ComponentLink1URL: https://www.diodes.com/assets/Datasheets/SDT3A45SA.pdf; ComponentLink2Description: DigiKey Link; ComponentLink2URL: https://www.digikey.com/en/products/detail/diodes-incorporated/SDT3A45SA-13/8537862; Diode Type: Schottky; LastUpdated: 6/30/2022 10:48:15 PM; Lifecycle Status: Active; Minimum Order: 1; Mounting Type: Surface Mount; Operating Temperature - Junction: -65°C ~ 150°C; Package / Case: DO-214AC, SMA; Packaging: TapeAndReel; PartId: 1820; Part Status: Active; Price: 0.09; Series: -; Supplier 1: DigiKey; Supplier Part Number 1: SDT3A45SA-13DICT-ND; Supplier Device Package: SMA
IC1 IC2 = NTR3A30PZT1G: MOSFET P-CH 20V 3A SOT23; Manufacturer: ON Semiconductor; Current - Continuous Drain (Id) @ 25°C: 3A (Ta); Drive Voltage (Max Rds On,  Min Rds On): 1.8V, 4.5V; FET Type: P-Channel; Gate Charge (Qg) (Max) @ Vgs: 17.6nC @ 4.5V; Input Capacitance (Ciss) (Max) @ Vds: 1651pF @ 15V; Power Dissipation (Max): 480mW (Ta); Rds On (Max) @ Id, Vgs: 38mOhm @ 3A, 4.5V; Vgs (Max): ±8V; Vgs(th) (Max) @ Id: 1V @ 250µA; Part Number: NTR3A30PZT1G; ComponentLink1Description: Datasheet; ComponentLink1URL: http://www.onsemi.com/pub/Collateral/NTR3A30PZ-D.PDF; ComponentLink2Description: DigiKey Link; ComponentLink2URL: http://digikey.com/product-detail/en/on-semiconductor/NTR3A30PZT1G/NTR3A30PZT1GOSCT-ND/5723269; Drain to Source Voltage (Vdss): 20V; LastUpdated: 6/30/2022 10:59:40 PM; Lifecycle Status: Active; Minimum Order: 1; Mounting Type: Surface Mount; Operating Temperature: -55°C ~ 150°C (TJ); Package / Case: TO-236-3, SC-59, SOT-23-3; Packaging: TapeAndReel; Part Status: Active; Price: 0.23; Series: -; Supplier 1: DigiKey; Supplier Part Number 1: NTR3A30PZT1GOSCT-ND; Supplier Device Package: SOT-23-3 (TO-236); Technology: MOSFET (Metal Oxide)
J8 = B2B-XH-A(LF)(SN): Connector Header Through Hole 2 position 0.098" (2.50mm); MF: {'manufacturer': u'JST Sales'}; Price: None; Value: *; Package: None; Availability: Unavailable; MP: B2B-XH-A(LF)(SN)
L1 = SRP5030T-5R6M: FIXED IND 5.6UH 4.25A 63MOHM SMD; Manufacturer: Bourns Inc.; Current - Saturation: 4.5A; DC Resistance (DCR): 63mOhm Max; Inductance Frequency - Test: 100 kHz; Material - Core: Iron Powder; Shielding: Shielded; Tolerance: ±20%; Type: Drum Core, Wirewound; Part Number: SRP5030T-5R6M; ComponentLink1Description: Datasheet; ComponentLink1URL: https://www.bourns.com/docs/Product-Datasheets/SRP5030T.pdf; ComponentLink2Description: DigiKey Link; ComponentLink2URL: https://www.digikey.com/en/products/detail/bourns-inc/SRP5030T-5R6M/3986085; Current Rating (Amps): 4.25 A; Device Package: Nonstandard; Height - Seated (Max): 0.118" (3.00mm); Inductance: 5.6 µH; LastUpdated: 6/30/2022 10:52:36 PM; Lifecycle Status: Active; Minimum Order: 1; Mounting Type: Surface Mount; Operating Temperature: -40°C ~ 125°C; Package / Case: Nonstandard; Packaging: TapeAndReel; PartId: 10; Part Status: Active; Price: 0.66; Series: SRP5030T; Size / Dimension: 0.224" L x 0.205" W (5.70mm x 5.20mm); Supplier 1: DigiKey; Supplier Part Number 1: SRP5030T-5R6MCT-ND; Value: 5.6 µH
R65 = RT1206BRD07150RL: RES SMD 150 OHM 0.1% 1/4W 1206; Manufacturer: Yageo; Power (Watts): 0.25W, 1/4W; Temperature Coefficient: ±25ppm/°C; Part Number: RT1206BRD07150RL; ComponentLink1Description: Datasheet; ComponentLink1URL: https://www.yageo.com/upload/media/product/productsearch/datasheet/rchip/PYu-RT_1-to-0.01_RoHS_L_11.pdf; ComponentLink2Description: DigiKey Link; ComponentLink2URL: https://www.digikey.com/en/products/detail/yageo/RT1206BRD07150RL/1079534; Composition: Thin Film; Device Package: 1206 (3216 Metric); Height - Seated (Max): 0.026" (0.65mm); LastUpdated: 6/30/2022 10:32:38 PM; Lifecycle Status: Active; Minimum Order: 1; Number of Terminations: 2; Operating Temperature: -55°C ~ 155°C; Package / Case: 1206 (3216 Metric); Packaging: TapeAndReel; PartId: 26861; Part Status: Active; Price: 0.10; Resistance: 150 Ohms; Series: RT; Size / Dimension: 0.122" L x 0.063" W (3.10mm x 1.60mm); Supplier 1: DigiKey; Supplier Part Number 1: YAG5032CT-ND; Supplier Device Package: 1206; Tolerance: ±0.1%; Value: 150 Ohms
R66 = RMCF0805JT620K: RES 620K OHM 5% 1/8W 0805; Manufacturer: Stackpole Electronics Inc; Power (Watts): 0.125W, 1/8W; Temperature Coefficient: ±200ppm/°C; Part Number: RMCF0805JT620K; Value: 620 kOhms; ComponentLink1Description: Datasheet; ComponentLink1URL: https://www.seielect.com/catalog/sei-rmcf_rmcp.pdf; ComponentLink2Description: DigiKey Link; ComponentLink2URL: https://www.digikey.com/en/products/detail/stackpole-electronics-inc/RMCF0805JT620K/1757918; Composition: Thick Film; Device Package: 0805 (2012 Metric); Features: Automotive AEC-Q200; Height - Seated (Max): 0.026" (0.65mm); LastUpdated: 6/30/2022 10:39:22 PM; Lifecycle Status: Active; Minimum Order: 1; Number of Terminations: 2; Operating Temperature: -55°C ~ 155°C; Package / Case: 0805 (2012 Metric); Packaging: CutTape; PartId: 29602; Part Status: Active; Price: 0.01; Ratings: AEC-Q200; Resistance: 620 kOhms; Series: RMCF; Size / Dimension: 0.079" L x 0.049" W (2.00mm x 1.25mm); Supplier 1: DigiKey; Supplier Part Number 1: RMCF0805JT620KCT-ND; Supplier Device Package: 0805; Tolerance: ±5%
R67 = RC0805JR-07360KL: RES 360K OHM 5% 1/8W 0805; Manufacturer: Yageo; Power (Watts): 0.125W, 1/8W; Temperature Coefficient: ±100ppm/°C; Part Number: RC0805JR-07360KL; Value: 360 kOhms; ComponentLink1Description: Datasheet; ComponentLink1URL: https://www.yageo.com/upload/media/product/productsearch/datasheet/rchip/PYu-RC_Group_51_RoHS_L_10.pdf; ComponentLink2Description: DigiKey Link; ComponentLink2URL: https://www.digikey.com/en/products/detail/yageo/RC0805JR-07360KL/728316; Composition: Thick Film; Device Package: 0805 (2012 Metric); Features: Moisture Resistant; Height - Seated (Max): 0.024" (0.60mm); LastUpdated: 6/30/2022 10:39:22 PM; Lifecycle Status: Active; Minimum Order: 1; Number of Terminations: 2; Operating Temperature: -55°C ~ 155°C; Package / Case: 0805 (2012 Metric); Packaging: CutTape; PartId: 29612; Part Status: Active; Price: 0.01; Resistance: 360 kOhms; Series: RC_L; Size / Dimension: 0.079" L x 0.049" W (2.00mm x 1.25mm); Supplier 1: DigiKey; Supplier Part Number 1: 311-360KARCT-ND; Supplier Device Package: 0805; Tolerance: ±5%
U5 = IC-BUCK-TPS64200DBVR: 1.8 to 6.5 V input, 350 kHz, 95% efficient step-down controller, 20 uA, SOT-23 6-SOT-23 -40 to 85; MF: Texas Instruments; SnapEDA_Link: https://www.snapeda.com/parts/TPS64200DBVR/Texas+Instruments/view-part/?ref=snap; Package: SOT-23-6 Texas Instruments; Availability: In Stock; Price: None; Purchase-URL: https://pricing.snapeda.com/search/part/TPS64200DBVR/?ref=eda; Check_prices: https://www.snapeda.com/parts/TPS64200DBVR/Texas+Instruments/view-part/?ref=eda; MP: TPS64200DBVR; Value: *

## Nets that join several sheets
+3V3: schematic (10 pins), power-supply (5 pins)
GND: schematic (13 pins), power-supply (9 pins)